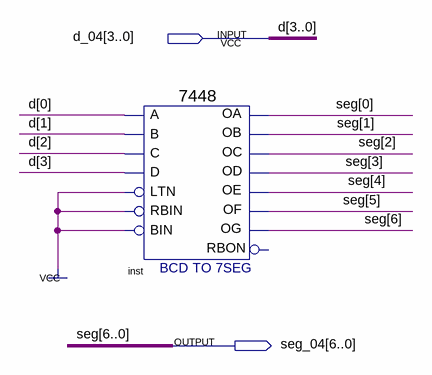
[diagram p0: schematic sheet]
// Quartus schematic decoder_04.bdf as structural Verilog: 1 symbols, 2 pins
module decoder_04 (
  input  [3:0] d_04,
  output [6:0] seg_04
);

  \7448  inst (
    .A(d_04[0]), .C(d_04[2]), .D(d_04[3]), .B(d_04[1]), .RBIN(1'b1), .BIN(1'b1), .LTN(1'b1), .OC(seg_04[2]),
    .OE(seg_04[4]), .OD(seg_04[3]), .OF(seg_04[5]), .OG(seg_04[6]), .OB(seg_04[1]), .OA(seg_04[0]));  // open: RBON

  // Other names for the same wires on the sheet: d[3:0] = d_04; seg[6:0] = seg_04
endmodule
